# EAGLE schematic bm812i (EAGLE 6.6.0)

## Sheet 1 of 5
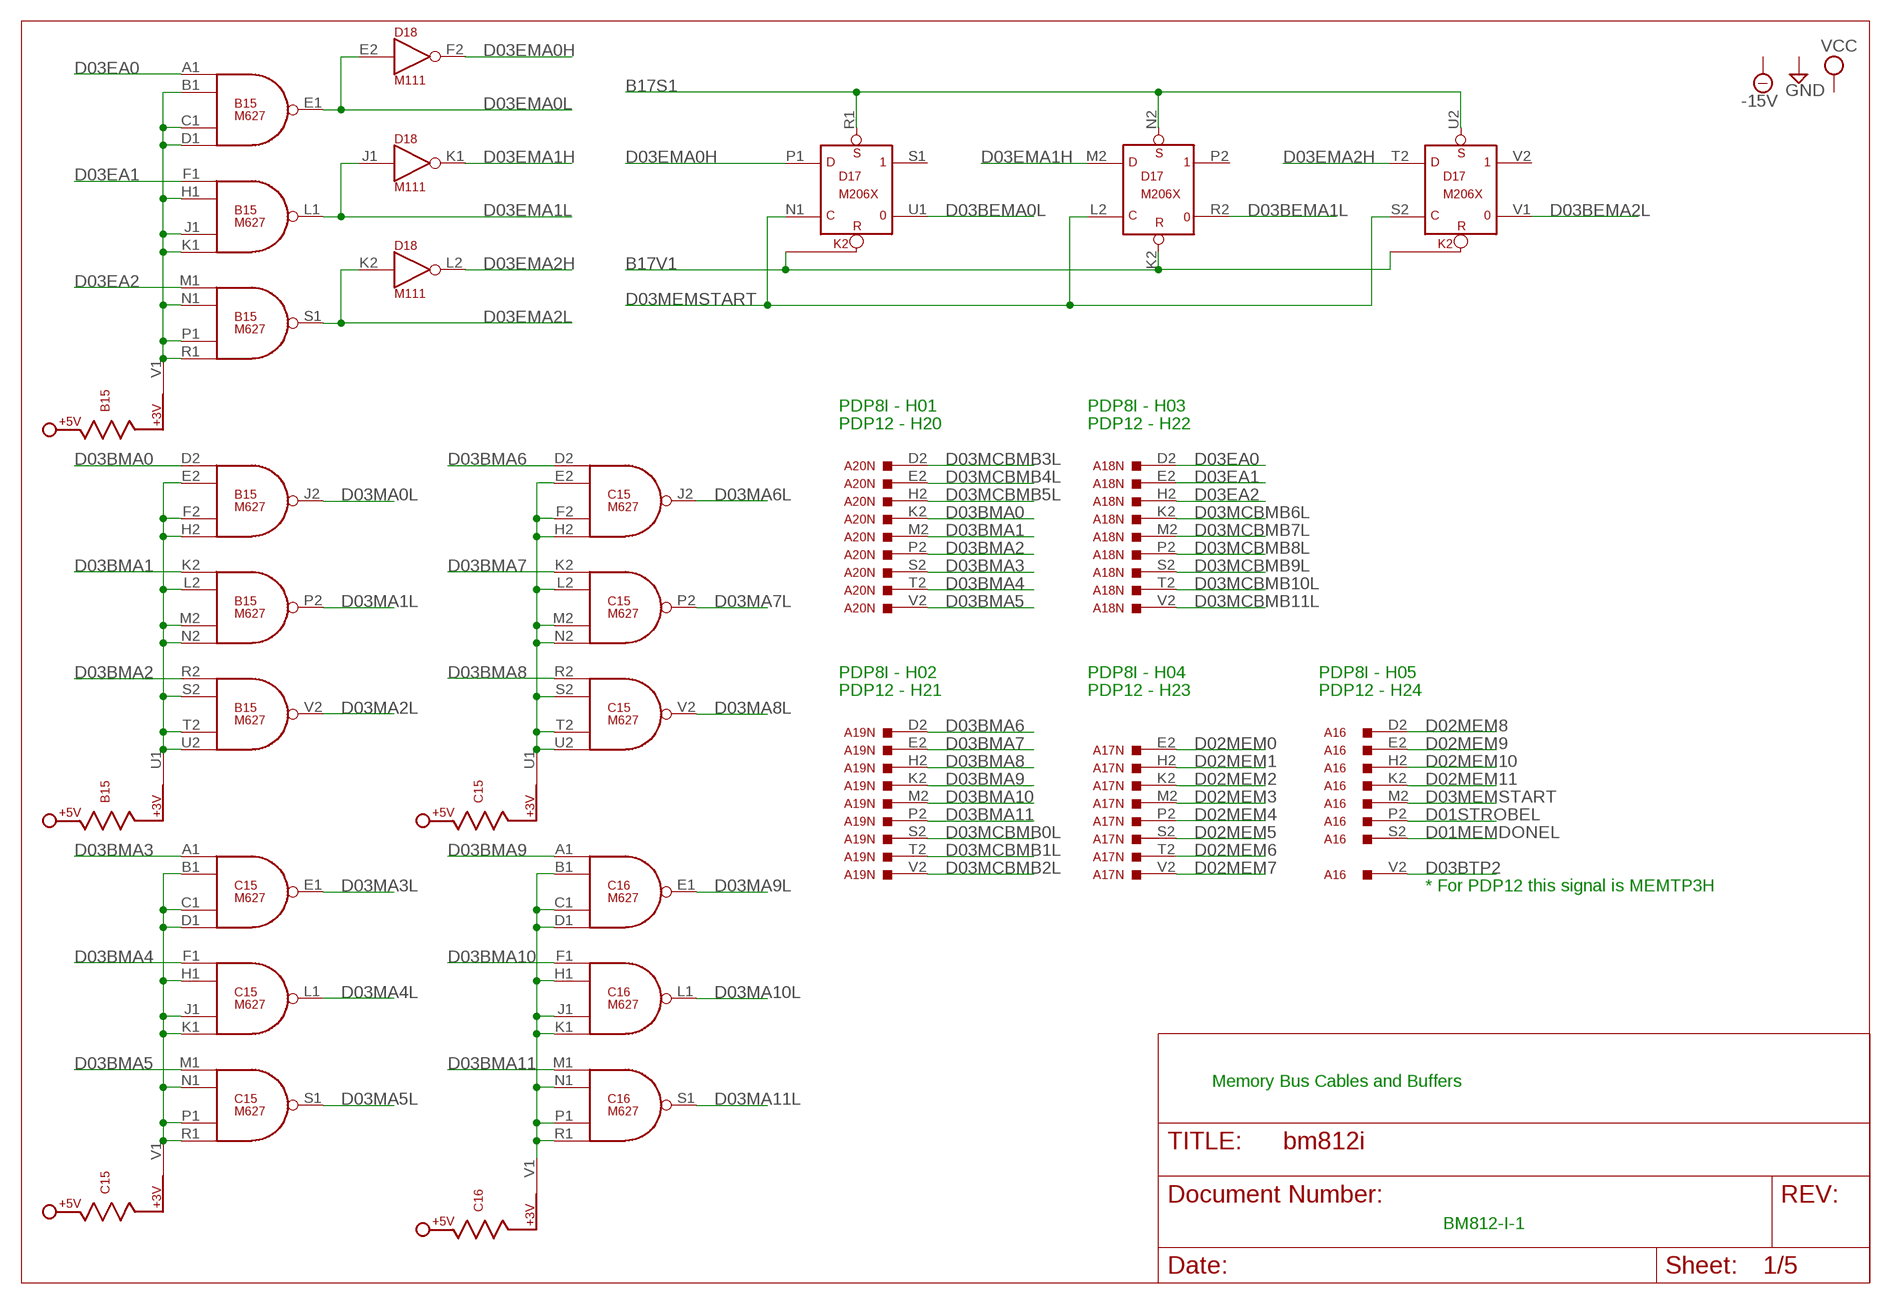
[diagram p0: schematic, sheet 1]

### Parts
A16  M903  [H807]
A17N  M903  [H807]
A18N  M903  [H807]
A19N  M903  [H807]
A20N  M903  [H807]
B15  M627  [H807]
C15  M627  [H807]
C16  M627  [H807]
D17  M206X  [H807]
D18  M111  [H807]

### Nets
B17S1: D17.N2(P2:S) D17.R1(S1:S) D17.U2(V2:S) ; also sheet 3,4
B17V1: D17.K2(P2:R) ; also sheet 3,4
D01MEMDONEL: A16.S2 ; also sheet 4
D01STROBEL: A16.P2 ; also sheet 4
D02MEM0: A17N.E2 ; also sheet 3
D02MEM1: A17N.H2 ; also sheet 3
D02MEM2: A17N.K2 ; also sheet 3
D02MEM3: A17N.M2 ; also sheet 3
D02MEM4: A17N.P2 ; also sheet 3
D02MEM5: A17N.S2 ; also sheet 3
D02MEM6: A17N.T2 ; also sheet 3
D02MEM7: A17N.V2 ; also sheet 3
D02MEM8: A16.D2 ; also sheet 3
D02MEM9: A16.E2 ; also sheet 3
D02MEM10: A16.H2 ; also sheet 3
D02MEM11: A16.K2 ; also sheet 3
D03BEMA0L: D17.U1 ; also sheet 5
D03BEMA1L: D17.R2 ; also sheet 5
D03BEMA2L: D17.V1 ; also sheet 5
D03BMA0: A20N.K2 B15.D2(J2:IN1)
D03BMA1: A20N.M2 B15.K2(P2:IN1)
D03BMA2: A20N.P2 B15.R2(V2:IN1)
D03BMA3: A20N.S2 C15.A1(E1:IN1)
D03BMA4: A20N.T2 C15.F1(L1:IN1)
D03BMA5: A20N.V2 C15.M1(S1:IN1)
D03BMA6: A19N.D2 C15.D2(J2:IN1)
D03BMA7: A19N.E2 C15.K2(P2:IN1)
D03BMA8: A19N.H2 C15.R2(V2:IN1)
D03BMA9: A19N.K2 C16.A1(E1:IN1)
D03BMA10: A19N.M2 C16.F1(L1:IN1)
D03BMA11: A19N.P2 C16.M1(S1:IN1)
D03BTP2: A16.V2 ; also sheet 4
D03EA0: A18N.D2 B15.A1(E1:IN1)
D03EA1: A18N.E2 B15.F1(L1:IN1)
D03EA2: A18N.H2 B15.M1(S1:IN1)
D03EMA0H: D17.P1(S1:D) D18.F2(F2:OUT) ; also sheet 4
D03EMA0L: B15.E1(E1:OUT) D18.E2(F2:IN) ; also sheet 4
D03EMA1H: D17.M2(P2:D) D18.K1(K1:OUT) ; also sheet 4
D03EMA1L: B15.L1(L1:OUT) D18.J1(K1:IN) ; also sheet 4
D03EMA2H: D17.T2(V2:D) D18.L2(L2:OUT) ; also sheet 4
D03EMA2L: B15.S1(S1:OUT) D18.K2(L2:IN) ; also sheet 4
D03MA0L: B15.J2(J2:OUT) ; also sheet 5
D03MA1L: B15.P2(P2:OUT) ; also sheet 5
D03MA2L: B15.V2(V2:OUT) ; also sheet 5
D03MA3L: C15.E1(E1:OUT) ; also sheet 5
D03MA4L: C15.L1(L1:OUT) ; also sheet 5
D03MA5L: C15.S1(S1:OUT) ; also sheet 5
D03MA6L: C15.J2(J2:OUT) ; also sheet 5
D03MA7L: C15.P2(P2:OUT) ; also sheet 5
D03MA8L: C15.V2(V2:OUT) ; also sheet 5
D03MA9L: C16.E1(E1:OUT) ; also sheet 5
D03MA10L: C16.L1(L1:OUT) ; also sheet 5
D03MA11L: C16.S1(S1:OUT) ; also sheet 5
D03MCBMB0L: A19N.S2 ; also sheet 3
D03MCBMB1L: A19N.T2 ; also sheet 3
D03MCBMB2L: A19N.V2 ; also sheet 3
D03MCBMB3L: A20N.D2 ; also sheet 3
D03MCBMB4L: A20N.E2 ; also sheet 3
D03MCBMB5L: A20N.H2 ; also sheet 3
D03MCBMB6L: A18N.K2 ; also sheet 3
D03MCBMB7L: A18N.M2 ; also sheet 3
D03MCBMB8L: A18N.P2 ; also sheet 3
D03MCBMB9L: A18N.S2 ; also sheet 3
D03MCBMB10L: A18N.T2 ; also sheet 3
D03MCBMB11L: A18N.V2 ; also sheet 3
D03MEMSTART: A16.M2 D17.L2(P2:C) D17.N1(S1:C) D17.S2(V2:C) ; also sheet 4
N$1: B15.B1(E1:IN2) B15.C1(E1:IN3) B15.D1(E1:IN4) B15.H1(L1:IN2) B15.J1(L1:IN3) B15.K1(L1:IN4) B15.N1(S1:IN2) B15.P1(S1:IN3) B15.R1(S1:IN4) B15.V1
N$2: B15.E2(J2:IN2) B15.F2(J2:IN3) B15.H2(J2:IN4) B15.L2(P2:IN2) B15.M2(P2:IN3) B15.N2(P2:IN4) B15.S2(V2:IN2) B15.T2(V2:IN3) B15.U1 B15.U2(V2:IN4)
N$4: C15.B1(E1:IN2) C15.C1(E1:IN3) C15.D1(E1:IN4) C15.H1(L1:IN2) C15.J1(L1:IN3) C15.K1(L1:IN4) C15.N1(S1:IN2) C15.P1(S1:IN3) C15.R1(S1:IN4) C15.V1
N$6: C15.E2(J2:IN2) C15.F2(J2:IN3) C15.H2(J2:IN4) C15.L2(P2:IN2) C15.M2(P2:IN3) C15.N2(P2:IN4) C15.S2(V2:IN2) C15.T2(V2:IN3) C15.U1 C15.U2(V2:IN4)
N$122: C16.B1(E1:IN2) C16.C1(E1:IN3) C16.D1(E1:IN4) C16.H1(L1:IN2) C16.J1(L1:IN3) C16.K1(L1:IN4) C16.N1(S1:IN2) C16.P1(S1:IN3) C16.R1(S1:IN4) C16.V1
Unconnected: A16.B1 A16.D1 A16.E1 A16.H1 A16.J1 A16.L1 A16.M1 A16.P1 A16.S1 A16.T2 A17N.B1 A17N.D1 A17N.D2 A17N.E1 A17N.H1 A17N.J1 A17N.L1 A17N.M1 A17N.P1 A17N.S1 A18N.B1 A18N.D1 A18N.E1 A18N.H1 A18N.J1 A18N.L1 A18N.M1 A18N.P1 A18N.S1 A19N.B1 A19N.D1 A19N.E1 A19N.H1 A19N.J1 A19N.L1 A19N.M1 A19N.P1 A19N.S1 A20N.B1 A20N.D1 A20N.E1 A20N.H1 A20N.J1 A20N.L1 A20N.M1 A20N.P1 A20N.S1 D17.D2(H2:C) D17.E2(H2:D) D17.F2(H2:S) D17.H1(L1:C) D17.H2 D17.J1(L1:D) D17.J2 D17.K1(L1:S) D17.L1 D17.M1 D17.P2 D17.S1 D17.V2 D18.L1(M1:IN) D18.M1(M1:OUT) D18.N1(P1:IN) D18.P1(P1:OUT) D18.P2(R2:IN) D18.R2(R2:OUT) D18.S2(T2:IN) D18.T2(T2:OUT) D18.U1(U1:OUT) D18.U2(V2:IN) D18.V1(U1:IN) D18.V2(V2:OUT)

### Notes on the sheet
- PDP8I - H01 | PDP8I - H03
- PDP12 - H20 | PDP12 - H22
- PDP8I - H02 | PDP8I - H04 | PDP8I - H05
- PDP12 - H21 | PDP12 - H23 | PDP12 - H24
- * For PDP12 this signal is MEMTP3H
- Memory Bus Cables and Buffers
- BM812-I-1

## Sheet 2 of 5
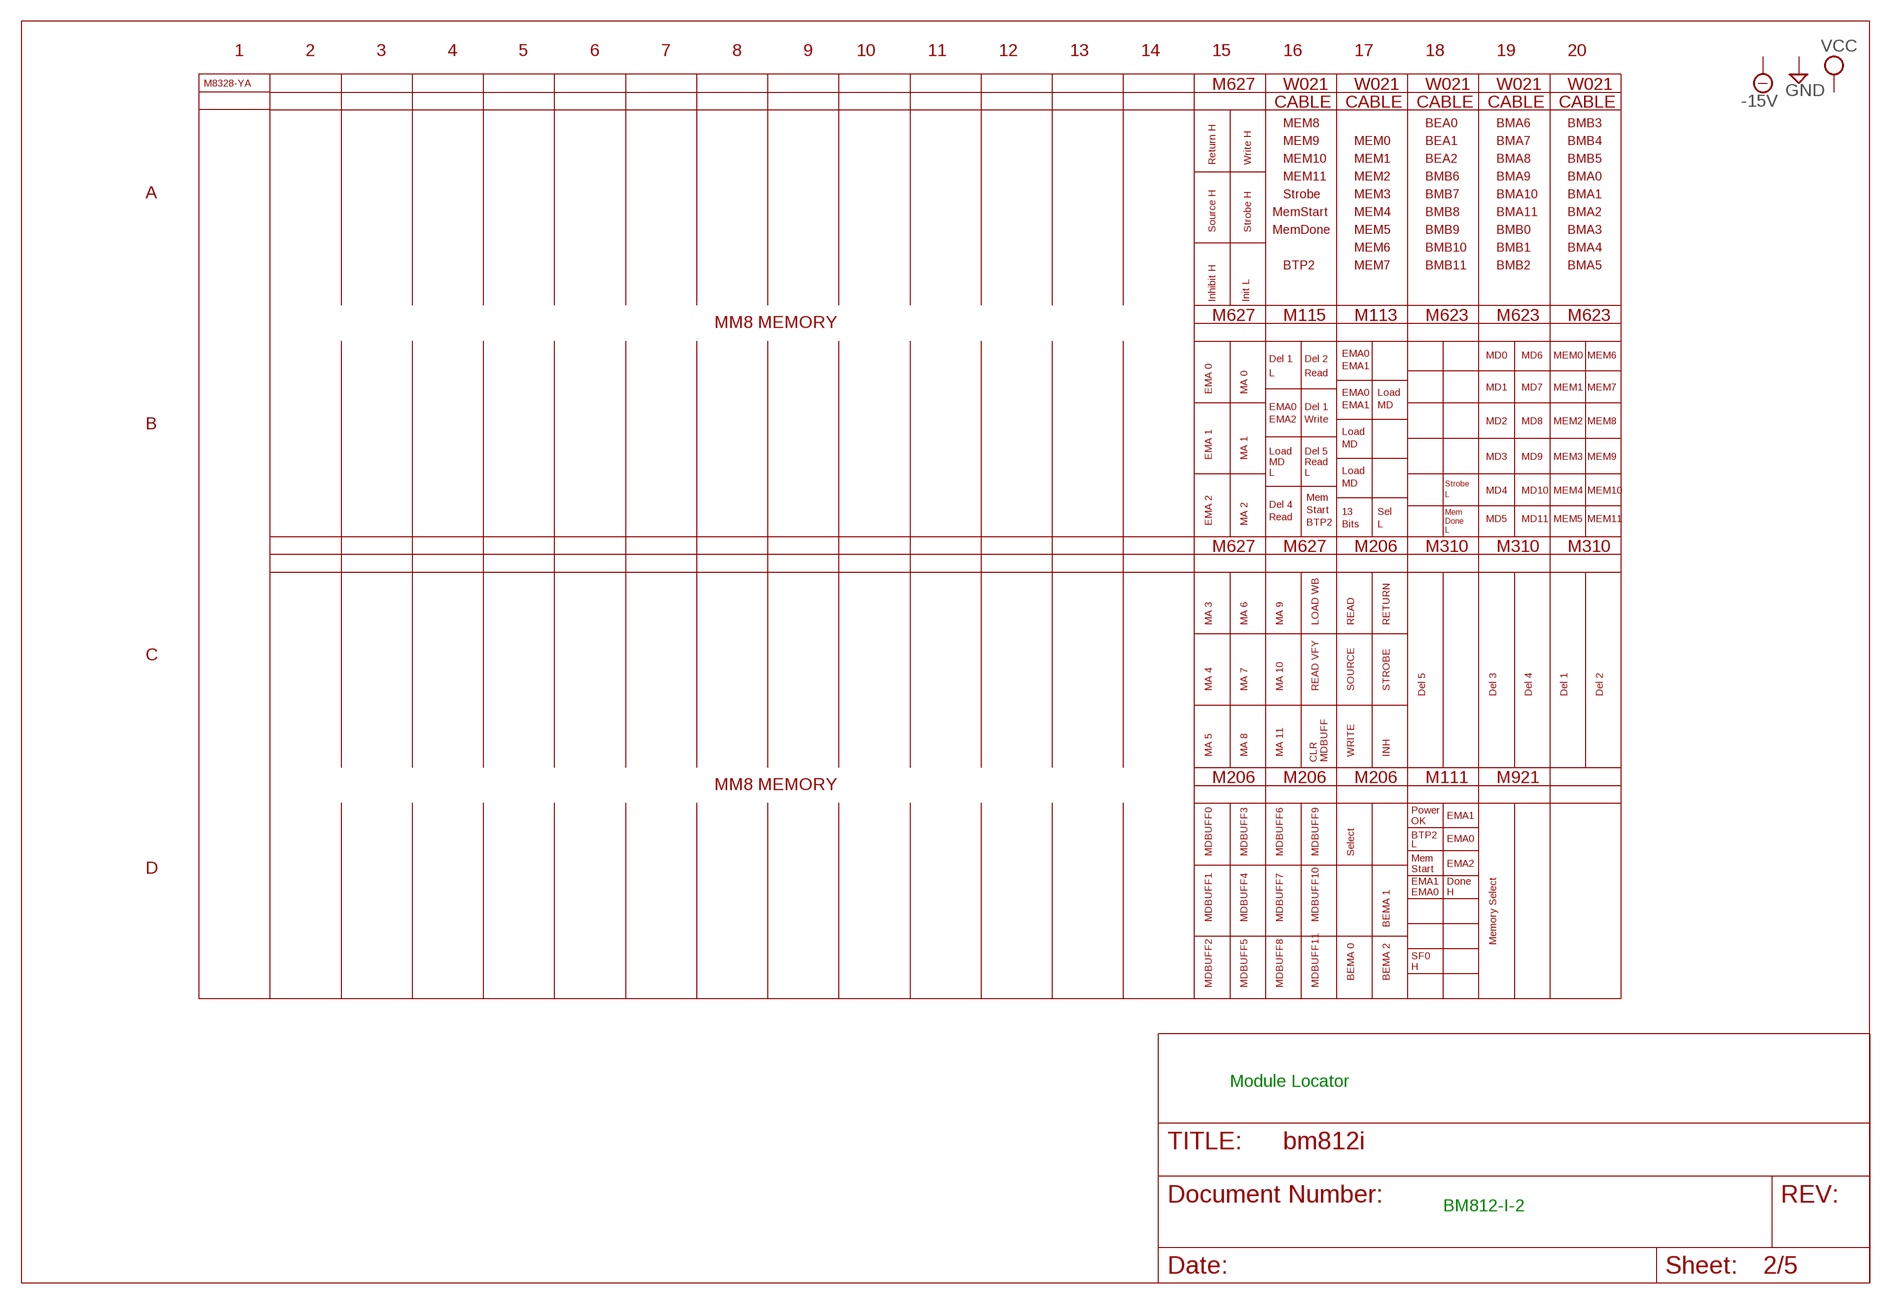
[diagram p1: schematic, sheet 2]

### Notes on the sheet
- 1 | 2 | 3 | 4 | 5 | 6 | 7 | 8 | 9 | 10 | 11 | 12 | 13 | 14 | 15 | 16 | 17 | 18 | 19 | 20
- M8328-YA
- M627 | W021 | W021 | W021 | W021 | W021
- CABLE | CABLE | CABLE | CABLE | CABLE
- MEM8 | BEA0 | BMA6 | BMB3
- MEM9 | MEM0 | BEA1 | BMA7 | BMB4
- Return H | Write H | MEM10 | MEM1 | BEA2 | BMA8 | BMB5
- MEM11 | MEM2 | BMB6 | BMA9 | BMA0
- A | Strobe | MEM3 | BMB7 | BMA10 | BMA1
- MemStart | MEM4 | BMB8 | BMA11 | BMA2
- Source H | Strobe H | MemDone | MEM5 | BMB9 | BMB0 | BMA3
- MEM6 | BMB10 | BMB1 | BMA4
- BTP2 | MEM7 | BMB11 | BMB2 | BMA5
- Inhibit H | Init L
- M627 | M115 | M113 | M623 | M623 | M623
- MM8 MEMORY
- EMA0 | MD0 | MD6 | MEM0 | MEM6
- Del 1 | Del 2
- EMA1
- L | Read
- MD1 | MD7 | MEM1 | MEM7
- EMA 0 | MA 0 | EMA0 | Load
- EMA0 | Del 1 | EMA1 | MD
- EMA2 | Write | MD2 | MD8 | MEM2 | MEM8
- B
- Load
- MD
- Load | Del 5
- EMA 1 | MA 1 | MD3 | MD9 | MEM3 | MEM9
- MD | Read
- L | L | Load
- MD | Strobe
- MD4 | MD10 | MEM4 | MEM10
- L
- Mem
- Del 4
- Start | 13 | Sel | Mem
- Read | MD5 | MD11 | MEM5 | MEM11
- EMA 2 | MA 2 | BTP2 | Done
- Bits | L
- L
- M627 | M627 | M206 | M310 | M310 | M310
- MA 3 | MA 6 | MA 9 | LOAD WB | READ | RETURN
- C
- MA 4 | MA 7 | MA 10 | READ VFY | SOURCE | STROBE
- Del 5 | Del 3 | Del 4 | Del 1 | Del 2
- MA 5 | MA 8 | MA 11 | WRITE | INH
- CLR | MDBUFF
- M206 | M206 | M206 | M111 | M921
- MM8 MEMORY
- Power
- EMA1
- OK
- BTP2
- EMA0
- L
- MDBUFF0 | MDBUFF3 | MDBUFF6 | MDBUFF9 | Select
- Mem
- EMA2
- D | Start
- EMA1 | Done
- EMA0 | H
- MDBUFF1 | MDBUFF4 | MDBUFF7 | MDBUFF10
- BEMA 1
- Memory Select
- SF0
- H
- BEMA 0 | BEMA 2
- MDBUFF2 | MDBUFF5 | MDBUFF8 | MDBUFF11
- Module Locator
- BM812-I-2

## Sheet 3 of 5
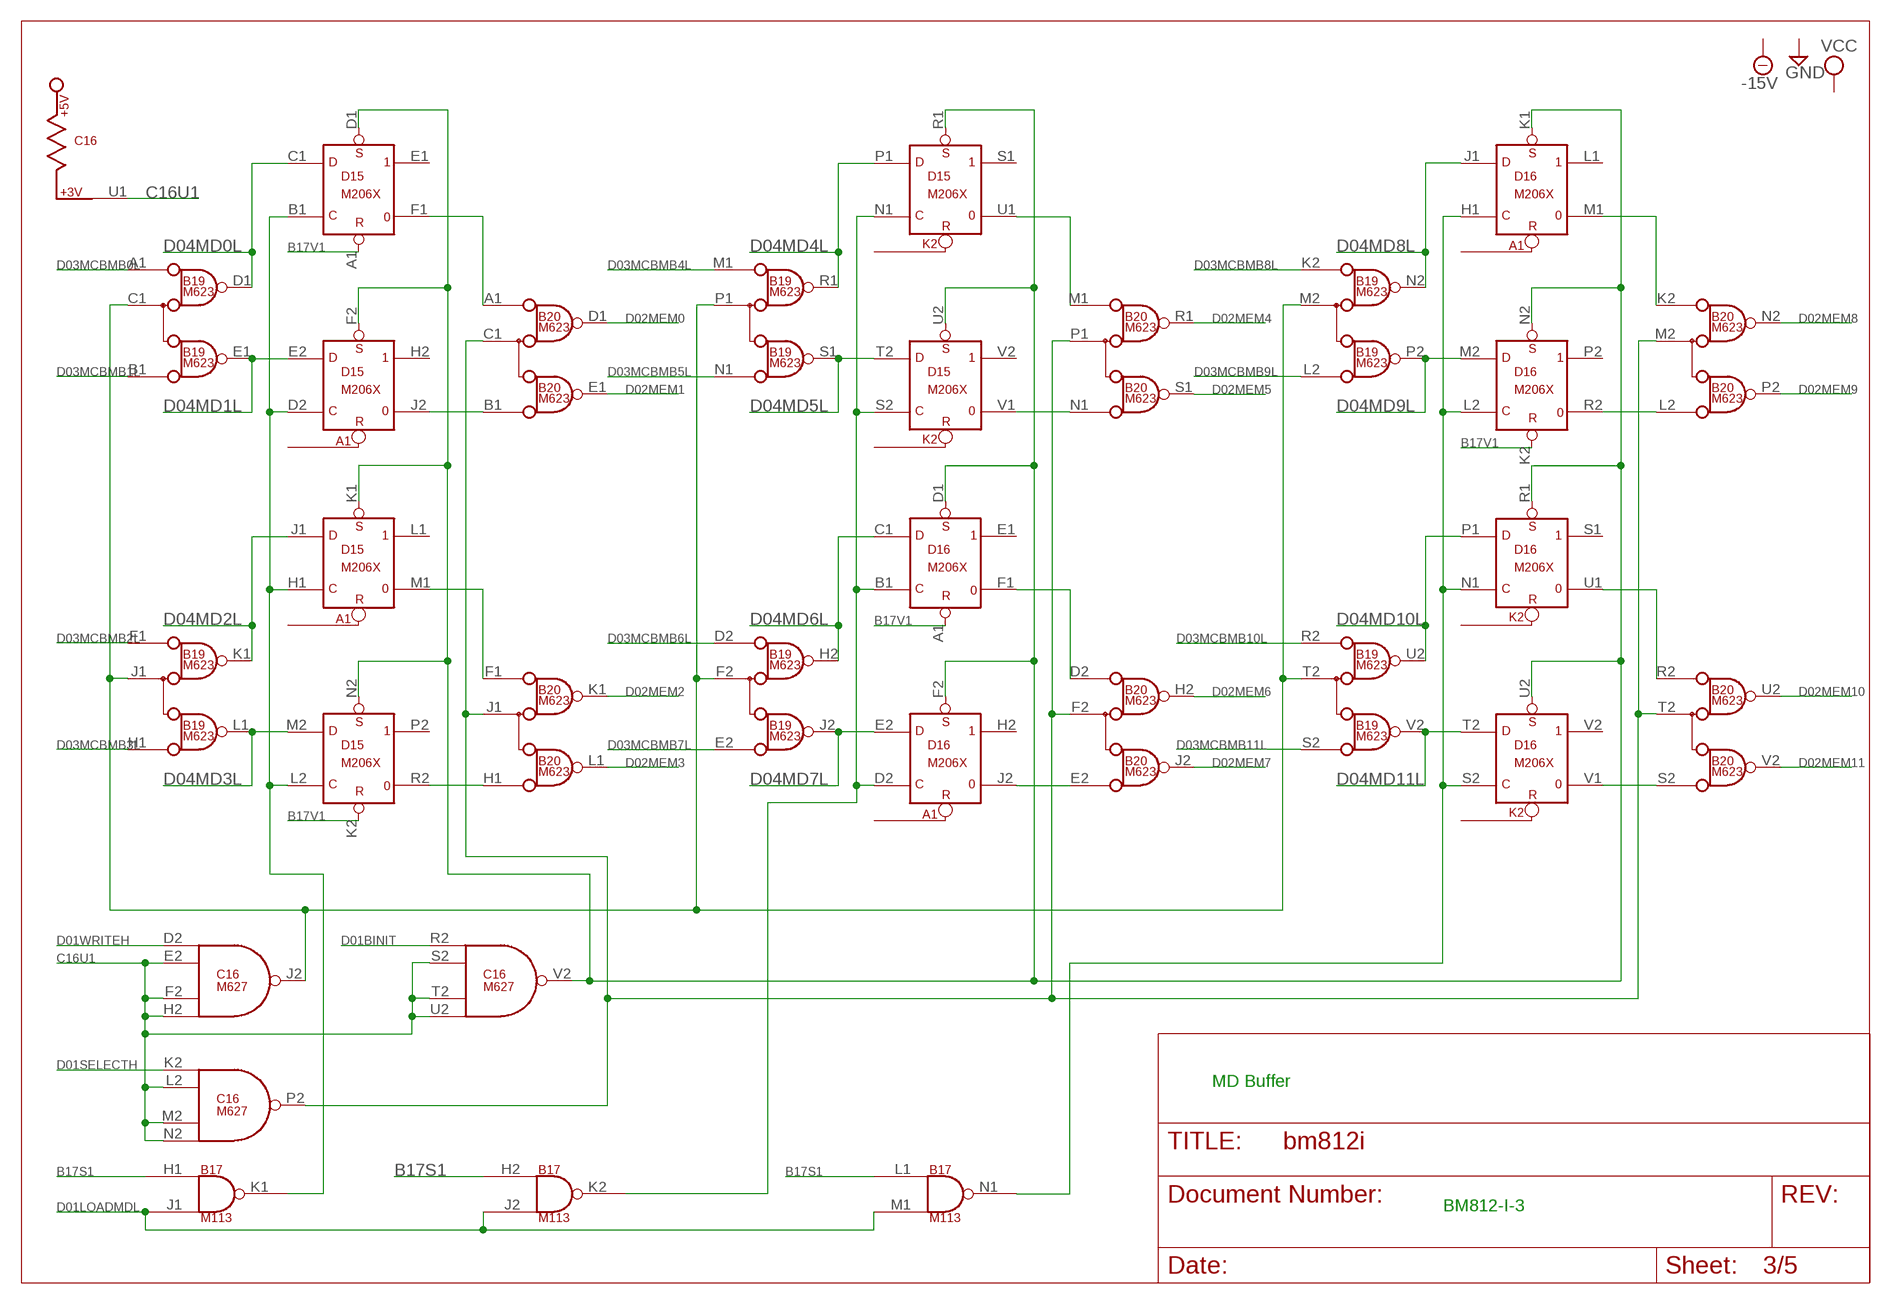
[diagram p2: schematic, sheet 3]

### Parts
B17  M113  [H807]
B19  M623  [H807]
B20  M623  [H807]
D15  M206X  [H807]
D16  M206X  [H807]

### Nets
B17S1: B17.H1(K1:IN1) B17.H2(K2:IN1) B17.L1(N1:IN1) ; also sheet 1,4
B17V1: D15.A1(E1:R) D15.K2(P2:R) D16.A1(E1:R) D16.K2(P2:R) ; also sheet 1,4
C16U1: C16.E2(J2:IN2) C16.F2(J2:IN3) C16.H2(J2:IN4) C16.L2(P2:IN2) C16.M2(P2:IN3) C16.N2(P2:IN4) C16.S2(V2:IN2) C16.T2(V2:IN3) C16.U1 C16.U2(V2:IN4)
D01BINIT: C16.R2(V2:IN1) ; also sheet 4
D01LOADMDL: B17.J1(K1:IN2) B17.J2(K2:IN2) B17.M1(N1:IN2) ; also sheet 4
D01SELECTH: C16.K2(P2:IN1) ; also sheet 4
D01WRITEH: C16.D2(J2:IN1) ; also sheet 4
D02MEM0: B20.D1(D1:D) ; also sheet 1
D02MEM1: B20.E1(D1:E) ; also sheet 1
D02MEM2: B20.K1(K1:D) ; also sheet 1
D02MEM3: B20.L1(K1:E) ; also sheet 1
D02MEM4: B20.R1(R1:D) ; also sheet 1
D02MEM5: B20.S1(R1:E) ; also sheet 1
D02MEM6: B20.H2(H2:D) ; also sheet 1
D02MEM7: B20.J2(H2:E) ; also sheet 1
D02MEM8: B20.N2(N2:D) ; also sheet 1
D02MEM9: B20.P2(N2:E) ; also sheet 1
D02MEM10: B20.U2(U2:D) ; also sheet 1
D02MEM11: B20.V2(U2:E) ; also sheet 1
D03MCBMB0L: B19.A1(D1:A) ; also sheet 1
D03MCBMB1L: B19.B1(D1:B) ; also sheet 1
D03MCBMB2L: B19.F1(K1:A) ; also sheet 1
D03MCBMB3L: B19.H1(K1:B) ; also sheet 1
D03MCBMB4L: B19.M1(R1:A) ; also sheet 1
D03MCBMB5L: B19.N1(R1:B) ; also sheet 1
D03MCBMB6L: B19.D2(H2:A) ; also sheet 1
D03MCBMB7L: B19.E2(H2:B) ; also sheet 1
D03MCBMB8L: B19.K2(N2:A) ; also sheet 1
D03MCBMB9L: B19.L2(N2:B) ; also sheet 1
D03MCBMB10L: B19.R2(U2:A) ; also sheet 1
D03MCBMB11L: B19.S2(U2:B) ; also sheet 1
D04MD0L: B19.D1(D1:D) D15.C1(E1:D) ; also sheet 5
D04MD1L: B19.E1(D1:E) D15.E2(H2:D) ; also sheet 5
D04MD2L: B19.K1(K1:D) D15.J1(L1:D) ; also sheet 5
D04MD3L: B19.L1(K1:E) D15.M2(P2:D) ; also sheet 5
D04MD4L: B19.R1(R1:D) D15.P1(S1:D) ; also sheet 5
D04MD5L: B19.S1(R1:E) D15.T2(V2:D) ; also sheet 5
D04MD6L: B19.H2(H2:D) D16.C1(E1:D) ; also sheet 5
D04MD7L: B19.J2(H2:E) D16.E2(H2:D) ; also sheet 5
D04MD8L: B19.N2(N2:D) D16.J1(L1:D) ; also sheet 5
D04MD9L: B19.P2(N2:E) D16.M2(P2:D) ; also sheet 5
D04MD10L: B19.U2(U2:D) D16.P1(S1:D) ; also sheet 5
D04MD11L: B19.V2(U2:E) D16.T2(V2:D) ; also sheet 5
N$8: B17.K1(K1:OUT) D15.B1(E1:C) D15.D2(H2:C) D15.H1(L1:C) D15.L2(P2:C)
N$12: B20.H1(K1:B) D15.R2
N$14: B20.A1(D1:A) D15.F1
N$15: B20.B1(D1:B) D15.J2
N$16: B17.K2(K2:OUT) D15.N1(S1:C) D15.S2(V2:C) D16.B1(E1:C) D16.D2(H2:C)
N$17: B20.F1(K1:A) D15.M1
N$20: B19.C1(D1:C) B19.F2(H2:C) B19.J1(K1:C) B19.M2(N2:C) B19.P1(R1:C) B19.T2(U2:C) C16.J2(J2:OUT)
N$21: C16.V2(V2:OUT) D15.D1(E1:S) D15.F2(H2:S) D15.K1(L1:S) D15.N2(P2:S) D15.R1(S1:S) D15.U2(V2:S) D16.D1(E1:S) D16.F2(H2:S) D16.K1(L1:S) D16.N2(P2:S) D16.R1(S1:S) D16.U2(V2:S)
N$22: B20.C1(D1:C) B20.F2(H2:C) B20.J1(K1:C) B20.M2(N2:C) B20.P1(R1:C) B20.T2(U2:C) C16.P2(P2:OUT)
N$24: B20.N1(R1:B) D15.V1
N$25: B20.E2(H2:B) D16.J2
N$26: B20.D2(H2:A) D16.F1
N$27: B20.M1(R1:A) D15.U1
N$29: B20.S2(U2:B) D16.V1
N$30: B20.R2(U2:A) D16.U1
N$41: B17.N1(N1:OUT) D16.H1(L1:C) D16.L2(P2:C) D16.N1(S1:C) D16.S2(V2:C)
N$67: B20.L2(N2:B) D16.R2
N$68: B20.K2(N2:A) D16.M1
Unconnected: B17.D2(F2:IN1) B17.E2(F2:IN2) B17.F2(F2:OUT) B17.L2(N2:IN1) B17.M2(N2:IN2) B17.N2(N2:OUT) B17.P2(S2:IN1) B17.R2(S2:IN2) B17.S2(S2:OUT) D15.E1 D15.H2 D15.L1 D15.P2 D15.S1 D15.V2 D16.E1 D16.H2 D16.L1 D16.P2 D16.S1 D16.V2

### Notes on the sheet
- MD Buffer
- BM812-I-3

## Sheet 4 of 5
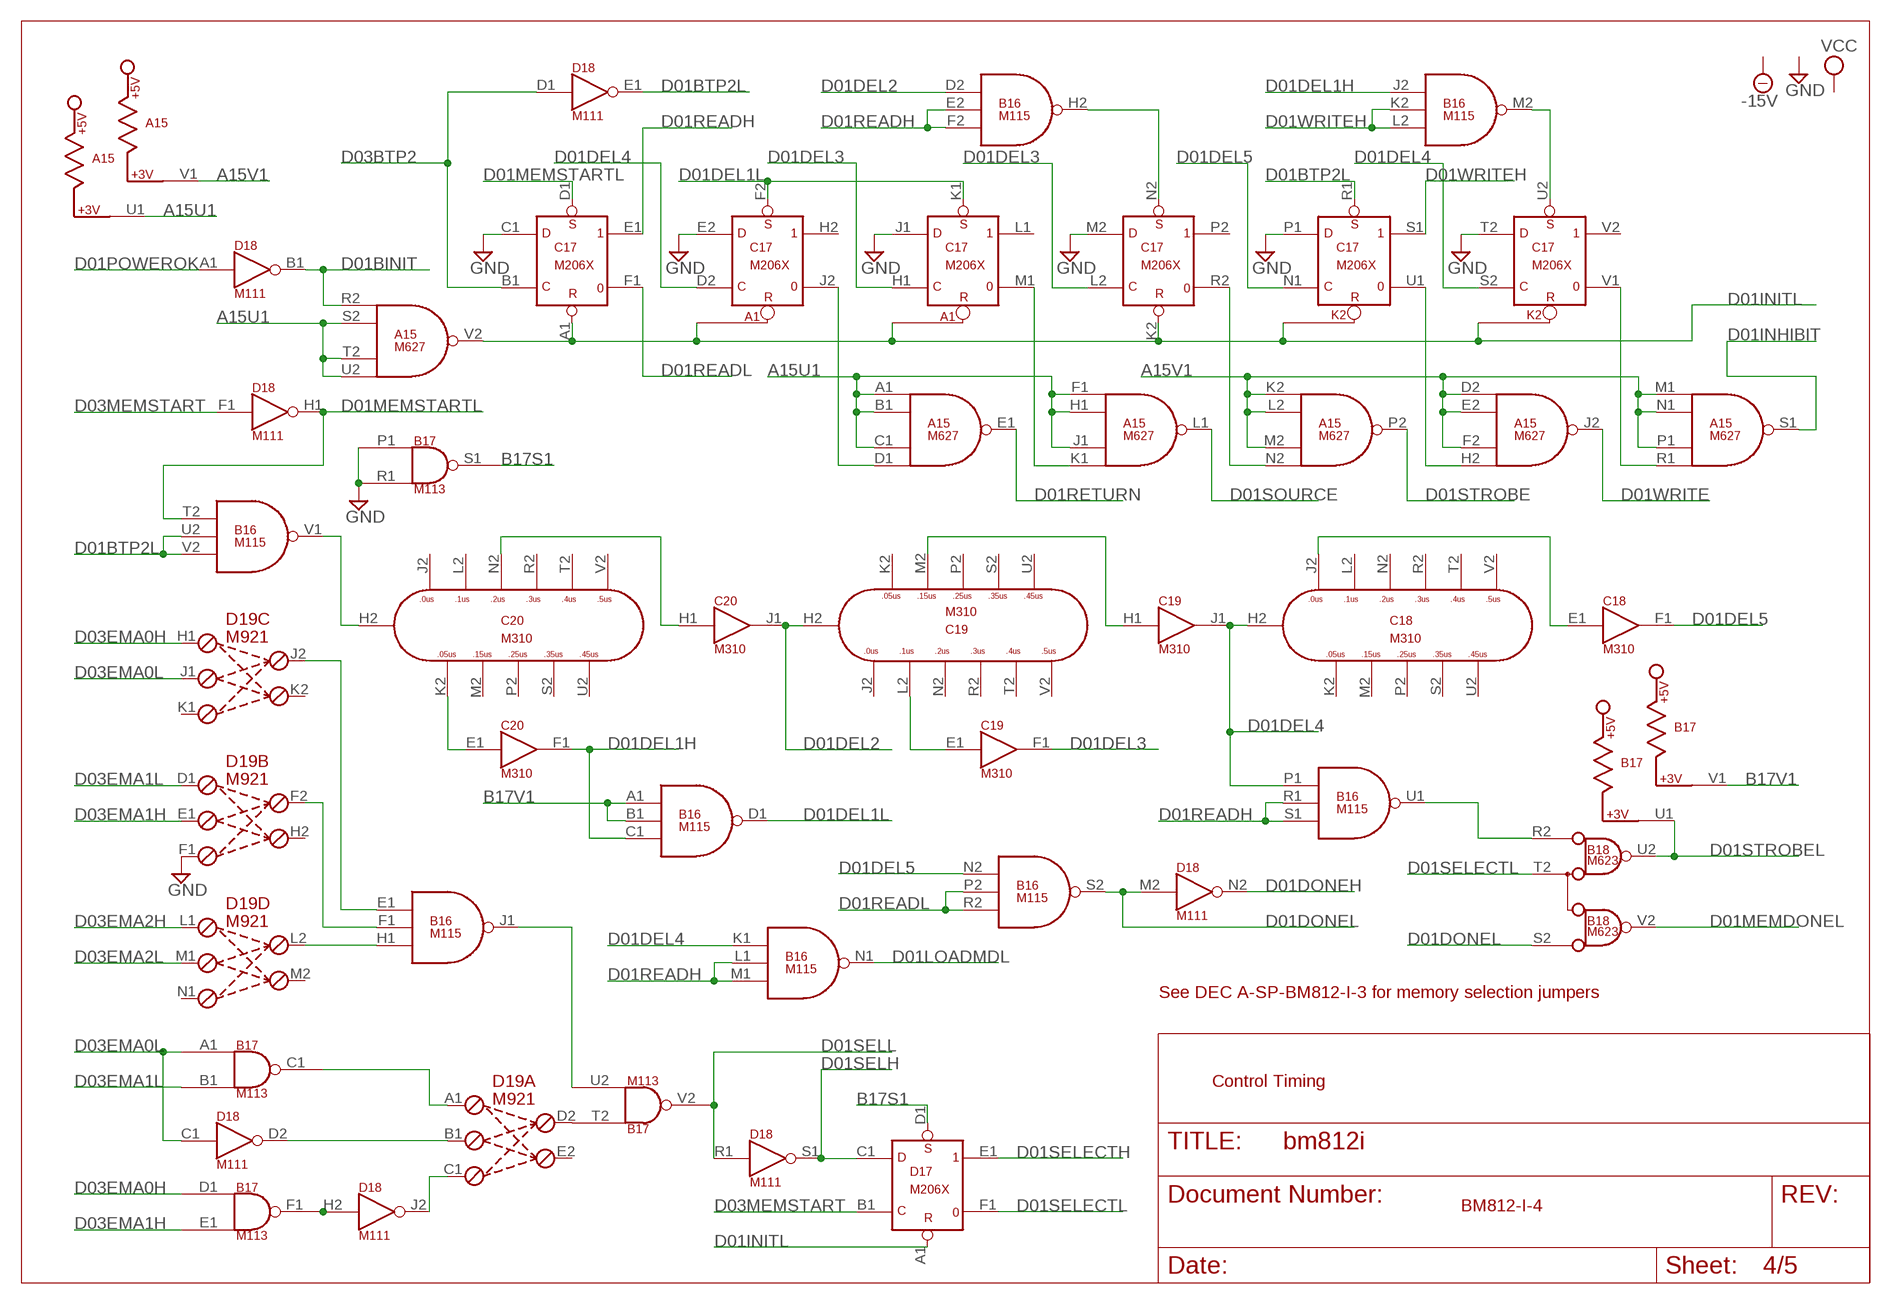
[diagram p3: schematic, sheet 4]

### Parts
A15  M627  [H807]
B16  M115  [H807]
B18  M623  [H807]
C17  M206X  [H807]
C18  M310  [H807]
C19  M310  [H807]
C20  M310  [H807]
D19  M921  [H807]

### Nets
A15U1: A15.A1(E1:IN1) A15.B1(E1:IN2) A15.C1(E1:IN3) A15.F1(L1:IN1) A15.H1(L1:IN2) A15.J1(L1:IN3) A15.S2(V2:IN2) A15.T2(V2:IN3) A15.U1 A15.U2(V2:IN4) ; also sheet 5
A15V1: A15.D2(J2:IN1) A15.E2(J2:IN2) A15.F2(J2:IN3) A15.K2(P2:IN1) A15.L2(P2:IN2) A15.M1(S1:IN1) A15.M2(P2:IN3) A15.N1(S1:IN2) A15.P1(S1:IN3) A15.V1
B17S1: B17.S1(S1:OUT) D17.D1(E1:S) ; also sheet 1,3
B17V1: B16.A1(D1:IN1) B16.B1(D1:IN2) B17.V1 ; also sheet 1,3
D01BINIT: A15.R2(V2:IN1) D18.B1(B1:OUT) ; also sheet 3
D01BTP2L: B16.U2(V1:IN2) B16.V2(V1:IN3) C17.R1(S1:S) D18.E1(E1:OUT)
D01DEL1H: B16.C1(D1:IN3) B16.J2(M2:IN1) C20.F1(F1:OUT)
D01DEL1L: B16.D1(D1:OUT) C17.F2(H2:S) C17.K1(L1:S)
D01DEL2: B16.D2(H2:IN1) C19.H2(H2:H2) C20.J1(J1:OUT)
D01DEL3: C17.H1(L1:C) C17.L2(P2:C) C19.F1(F1:OUT)
D01DEL4: B16.K1(N1:IN1) B16.P1(U1:IN1) C17.D2(H2:C) C17.S2(V2:C) C18.H2(H2:H2) C19.J1(J1:OUT)
D01DEL5: B16.N2(S2:IN1) C17.N1(S1:C) C18.F1(F1:OUT)
D01DONEH: D18.N2(N2:OUT) ; also sheet 5
D01DONEL: B16.S2(S2:OUT) B18.S2(U2:B) D18.M2(N2:IN)
D01INHIBIT: A15.S1(S1:OUT) ; also sheet 5
D01INITL: A15.V2(V2:OUT) C17.A1(E1:R) C17.K2(P2:R) D17.A1(E1:R)
D01LOADMDL: B16.N1(N1:OUT) ; also sheet 3
D01MEMDONEL: B18.V2(U2:E) ; also sheet 1
D01MEMSTARTL: B16.T2(V1:IN1) C17.D1(E1:S) D18.H1(H1:OUT)
D01POWEROK: D18.A1(B1:IN) ; also sheet 5
D01READH: B16.E2(H2:IN2) B16.F2(H2:IN3) B16.L1(N1:IN2) B16.M1(N1:IN3) B16.R1(U1:IN2) B16.S1(U1:IN3) C17.E1
D01READL: B16.P2(S2:IN2) B16.R2(S2:IN3) C17.F1 ; also sheet 5
D01RETURN: A15.E1(E1:OUT) ; also sheet 5
D01SELECTH: D17.E1 ; also sheet 3
D01SELECTL: B18.T2(U2:C) D17.F1
D01SELH: D17.C1(E1:D) D18.S1(S1:OUT)
D01SELL: B17.V2(V2:OUT) D18.R1(S1:IN)
D01SOURCE: A15.L1(L1:OUT) ; also sheet 5
D01STROBE: A15.P2(P2:OUT) ; also sheet 5
D01STROBEL: B17.U1 B18.U2(U2:D) ; also sheet 1
D01WRITE: A15.J2(J2:OUT) ; also sheet 5
D01WRITEH: B16.K2(M2:IN2) B16.L2(M2:IN3) C17.S1 ; also sheet 3
D03BTP2: C17.B1(E1:C) D18.D1(E1:IN) ; also sheet 1
D03EMA0H: B17.D1(F1:IN1) D19.H1(C:L1) ; also sheet 1
D03EMA0L: B17.A1(C1:IN1) D18.C1(D2:IN) D19.J1(C:L2) ; also sheet 1
D03EMA1H: B17.E1(F1:IN2) D19.E1(B:L2) ; also sheet 1
D03EMA1L: B17.B1(C1:IN2) D19.D1(B:L1) ; also sheet 1
D03EMA2H: D19.L1(D:L1) ; also sheet 1
D03EMA2L: D19.M1(D:L2) ; also sheet 1
D03MEMSTART: D17.B1(E1:C) D18.F1(H1:IN) ; also sheet 1
GND [Power]: B17.P1(S1:IN1) B17.R1(S1:IN2) C17.C1(E1:D) C17.E2(H2:D) C17.J1(L1:D) C17.M2(P2:D) C17.P1(S1:D) C17.T2(V2:D) D19.F1(B:L3) ; also sheet 5
N$34: C19.H1(J1:IN) C19.M2(H2:M2)
N$35: B16.V1(V1:OUT) C20.H2(H2:H2)
N$46: B16.H2(H2:OUT) C17.N2(P2:S)
N$73: B17.C1(C1:OUT) D19.A1(A:L1)
N$91: C20.E1(F1:IN) C20.K2(H2:K2)
N$92: B16.M2(M2:OUT) C17.U2(V2:S)
N$93: C20.H1(J1:IN) C20.N2(H2:N2)
N$94: B16.U1(U1:OUT) B18.R2(U2:A)
N$96: A15.D1(E1:IN4) C17.J2
N$97: C19.E1(F1:IN) C19.L2(H2:L2)
N$99: C18.E1(F1:IN) C18.J2(H2:J2)
N$100: A15.K1(L1:IN4) C17.M1
N$101: A15.N2(P2:IN4) C17.R2
N$103: D18.D2(D2:OUT) D19.B1(A:L2)
N$104: A15.H2(J2:IN4) C17.U1
N$108: B17.F1(F1:OUT) D18.H2(J2:IN)
N$109: A15.R1(S1:IN4) C17.V1
N$111: D18.J2(J2:OUT) D19.C1(A:L3)
N$112: B17.T2(V2:IN1) D19.D2(A:R1)
N$113: B16.H1(J1:IN3) D19.L2(D:R1)
N$128: B16.F1(J1:IN2) D19.F2(B:R1)
N$129: B16.E1(J1:IN1) D19.J2(C:R1)
N$132: B16.J1(J1:OUT) B17.U2(V2:IN2)
Unconnected: B18.A1(D1:A) B18.B1(D1:B) B18.C1(D1:C) B18.D1(D1:D) B18.D2(H2:A) B18.E1(D1:E) B18.E2(H2:B) B18.F1(K1:A) B18.F2(H2:C) B18.H1(K1:B) B18.H2(H2:D) B18.J1(K1:C) B18.J2(H2:E) B18.K1(K1:D) B18.K2(N2:A) B18.L1(K1:E) B18.L2(N2:B) B18.M1(R1:A) B18.M2(N2:C) B18.N1(R1:B) B18.N2(N2:D) B18.P1(R1:C) B18.P2(N2:E) B18.R1(R1:D) B18.S1(R1:E) C17.H2 C17.L1 C17.P2 C17.V2 C18.H1(J1:IN) C18.J1(J1:OUT) C18.K2(H2:K2) C18.L2(H2:L2) C18.M2(H2:M2) C18.N2(H2:N2) C18.P2(H2:P2) C18.R2(H2:R2) C18.S2(H2:S2) C18.T2(H2:T2) C18.U2(H2:U2) C18.V2(H2:V2) C19.J2(H2:J2) C19.K2(H2:K2) C19.N2(H2:N2) C19.P2(H2:P2) C19.R2(H2:R2) C19.S2(H2:S2) C19.T2(H2:T2) C19.U2(H2:U2) C19.V2(H2:V2) C20.J2(H2:J2) C20.L2(H2:L2) C20.M2(H2:M2) C20.P2(H2:P2) C20.R2(H2:R2) C20.S2(H2:S2) C20.T2(H2:T2) C20.U2(H2:U2) C20.V2(H2:V2) D19.E2(A:R2) D19.H2(B:R2) D19.K1(C:L3) D19.K2(C:R2) D19.M2(D:R2) D19.N1(D:L3) D19.N2(E:R1) D19.P1(E:L1) D19.P2(E:R2) D19.R1(E:L2) D19.R2(F:R2) D19.S1(E:L3) D19.S2(F:L1) D19.T2(F:R1) D19.U1(F:L2) D19.V1(F:L3)

### Notes on the sheet
- See DEC A-SP-BM812-I-3 for memory selection jumpers
- Control Timing
- BM812-I-4

## Sheet 5 of 5
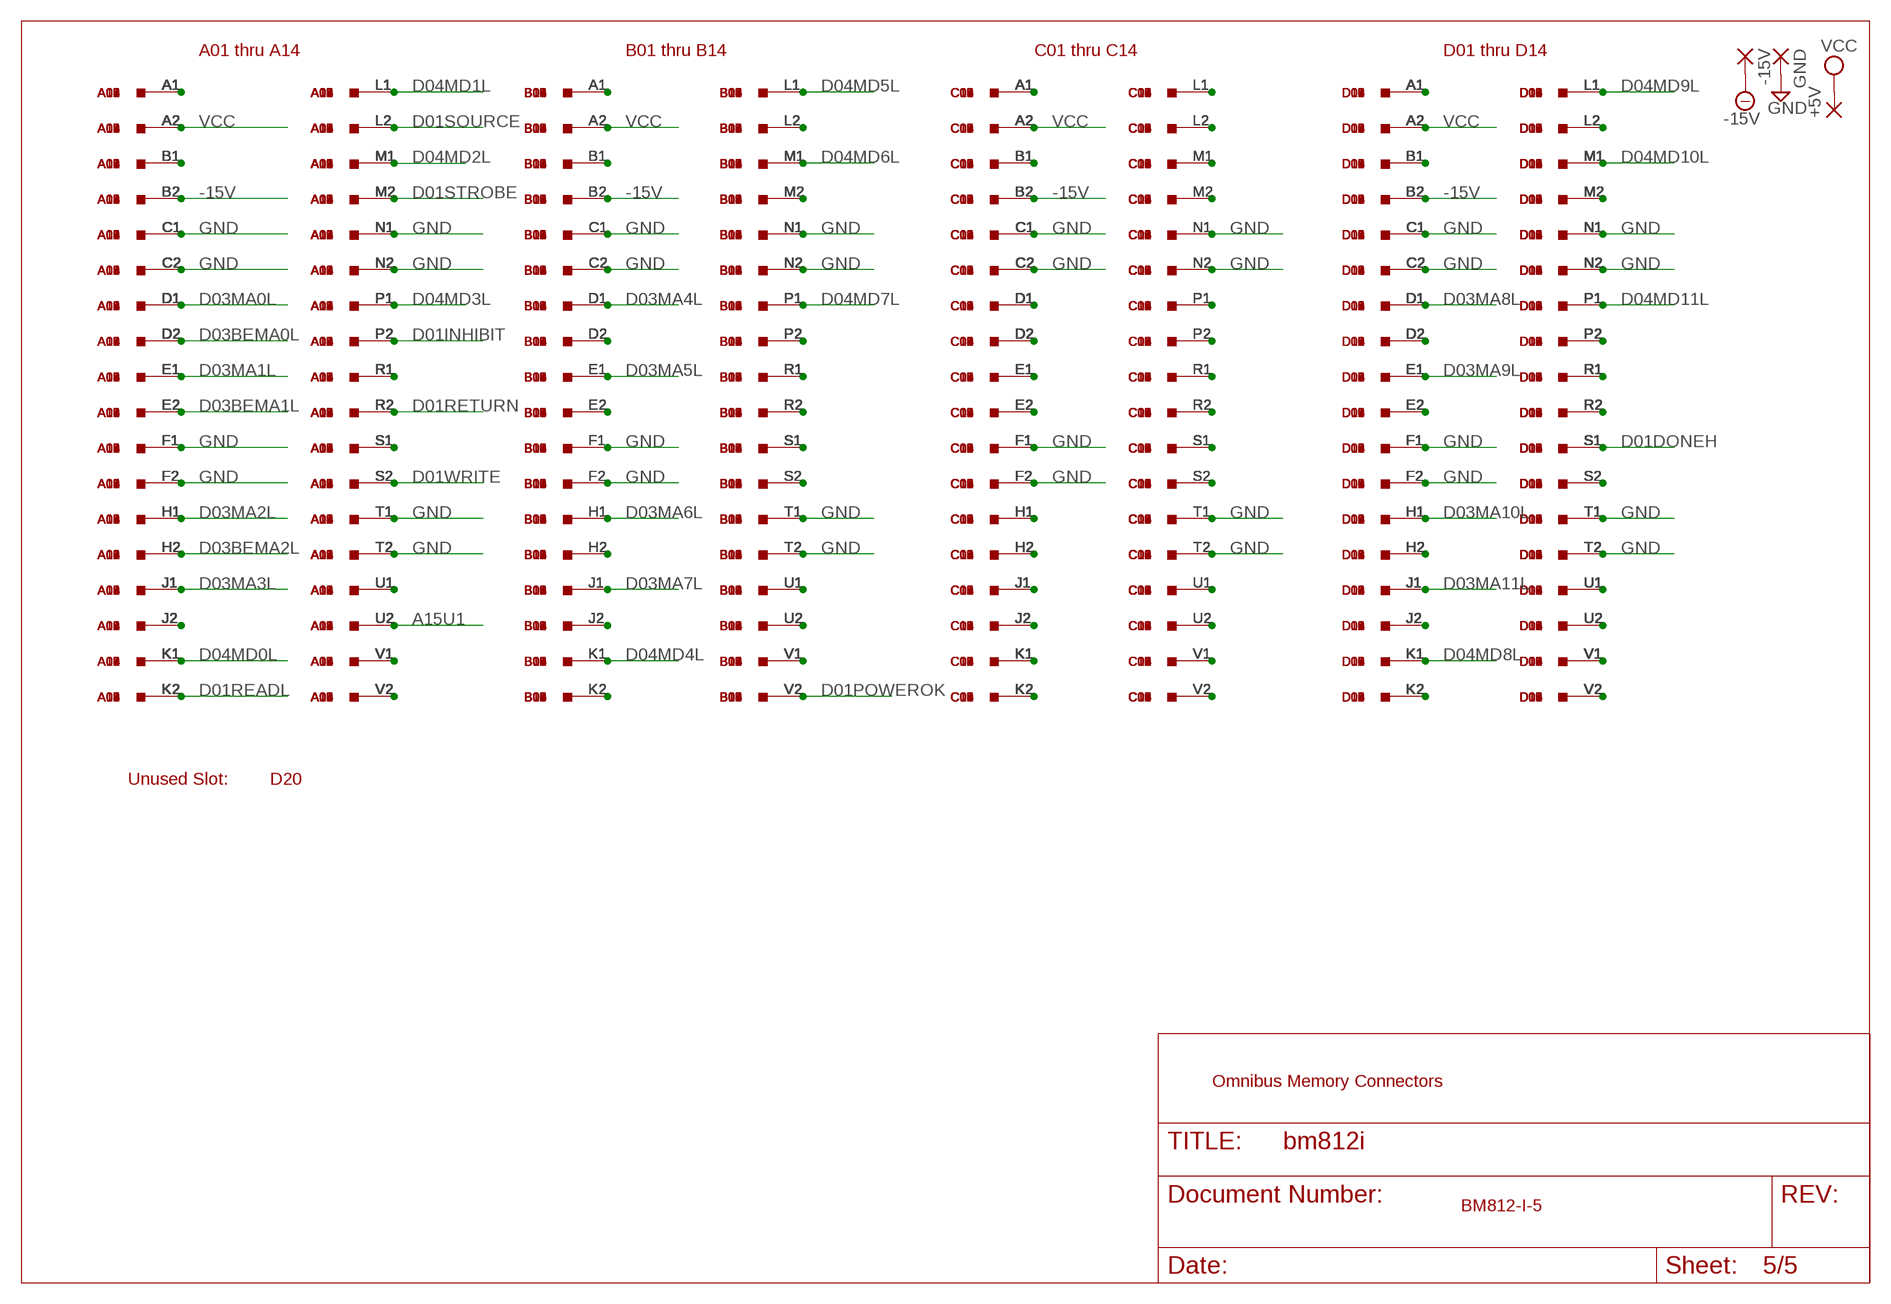
[diagram p4: schematic, sheet 5]

### Parts
+5V  2,54/0,8  [2,54/0,8]
-15V  2,54/0,8  [2,54/0,8]
A01  M916  [H807]
A02  M916  [H807]
A03  M916  [H807]
A04  M916  [H807]
A05  M916  [H807]
A06  M916  [H807]
A07  M916  [H807]
A08  M916  [H807]
A09  M916  [H807]
A10  M916  [H807]
A11  M916  [H807]
A12  M916  [H807]
A13  M916  [H807]
A14  M916  [H807]
B01  M916  [H807]
B02  M916  [H807]
B03  M916  [H807]
B04  M916  [H807]
B05  M916  [H807]
B06  M916  [H807]
B07  M916  [H807]
B08  M916  [H807]
B09  M916  [H807]
B10  M916  [H807]
B11  M916  [H807]
B12  M916  [H807]
B13  M916  [H807]
B14  M916  [H807]
C01  M916  [H807]
C02  M916  [H807]
C03  M916  [H807]
C04  M916  [H807]
C05  M916  [H807]
C06  M916  [H807]
C07  M916  [H807]
C08  M916  [H807]
C09  M916  [H807]
C10  M916  [H807]
C11  M916  [H807]
C12  M916  [H807]
C13  M916  [H807]
C14  M916  [H807]
D01  M916  [H807]
D02  M916  [H807]
D03  M916  [H807]
D04  M916  [H807]
D05  M916  [H807]
D06  M916  [H807]
D07  M916  [H807]
D08  M916  [H807]
D09  M916  [H807]
D10  M916  [H807]
D11  M916  [H807]
D12  M916  [H807]
D13  M916  [H807]
D14  M916  [H807]
D20  H807  [H807]
GND  2,54/0,8  [2,54/0,8]

### Nets
-15V [Power]: -15V.1(P) A01.B2 A02.B2 A03.B2 A04.B2 A05.B2 A06.B2 A07.B2 A08.B2 A09.B2 A10.B2 A11.B2 A12.B2 A13.B2 A14.B2 B01.B2 B02.B2 B03.B2 B04.B2 B05.B2 B06.B2 B07.B2 B08.B2 B09.B2 B10.B2 B11.B2 B12.B2 B13.B2 B14.B2 C01.B2 C02.B2 C03.B2 C04.B2 C05.B2 C06.B2 C07.B2 C08.B2 C09.B2 C10.B2 C11.B2 C12.B2 C13.B2 C14.B2 D01.B2 D02.B2 D03.B2 D04.B2 D05.B2 D06.B2 D07.B2 D08.B2 D09.B2 D10.B2 D11.B2 D12.B2 D13.B2 D14.B2
A15U1: A01.U2 A02.U2 A03.U2 A04.U2 A05.U2 A06.U2 A07.U2 A08.U2 A09.U2 A10.U2 A11.U2 A12.U2 A13.U2 A14.U2 ; also sheet 4
D01DONEH: D01.S1 D02.S1 D03.S1 D04.S1 D05.S1 D06.S1 D07.S1 D08.S1 D09.S1 D10.S1 D11.S1 D12.S1 D13.S1 D14.S1 ; also sheet 4
D01INHIBIT: A01.P2 A02.P2 A03.P2 A04.P2 A05.P2 A06.P2 A07.P2 A08.P2 A09.P2 A10.P2 A11.P2 A12.P2 A13.P2 A14.P2 ; also sheet 4
D01POWEROK: B01.V2 B02.V2 B03.V2 B04.V2 B05.V2 B06.V2 B07.V2 B08.V2 B09.V2 B10.V2 B11.V2 B12.V2 B13.V2 B14.V2 ; also sheet 4
D01READL: A01.K2 A02.K2 A03.K2 A04.K2 A05.K2 A06.K2 A07.K2 A08.K2 A09.K2 A10.K2 A11.K2 A12.K2 A13.K2 A14.K2 ; also sheet 4
D01RETURN: A01.R2 A02.R2 A03.R2 A04.R2 A05.R2 A06.R2 A07.R2 A08.R2 A09.R2 A10.R2 A11.R2 A12.R2 A13.R2 A14.R2 ; also sheet 4
D01SOURCE: A01.L2 A02.L2 A03.L2 A04.L2 A05.L2 A06.L2 A07.L2 A08.L2 A09.L2 A10.L2 A11.L2 A12.L2 A13.L2 A14.L2 ; also sheet 4
D01STROBE: A01.M2 A02.M2 A03.M2 A04.M2 A05.M2 A06.M2 A07.M2 A08.M2 A09.M2 A10.M2 A11.M2 A12.M2 A13.M2 A14.M2 ; also sheet 4
D01WRITE: A01.S2 A02.S2 A03.S2 A04.S2 A05.S2 A06.S2 A07.S2 A08.S2 A09.S2 A10.S2 A11.S2 A12.S2 A13.S2 A14.S2 ; also sheet 4
D03BEMA0L: A01.D2 A02.D2 A03.D2 A04.D2 A05.D2 A06.D2 A07.D2 A08.D2 A09.D2 A10.D2 A11.D2 A12.D2 A13.D2 A14.D2 ; also sheet 1
D03BEMA1L: A01.E2 A02.E2 A03.E2 A04.E2 A05.E2 A06.E2 A07.E2 A08.E2 A09.E2 A10.E2 A11.E2 A12.E2 A13.E2 A14.E2 ; also sheet 1
D03BEMA2L: A01.H2 A02.H2 A03.H2 A04.H2 A05.H2 A06.H2 A07.H2 A08.H2 A09.H2 A10.H2 A11.H2 A12.H2 A13.H2 A14.H2 ; also sheet 1
D03MA0L: A01.D1 A02.D1 A03.D1 A04.D1 A05.D1 A06.D1 A07.D1 A08.D1 A09.D1 A10.D1 A11.D1 A12.D1 A13.D1 A14.D1 ; also sheet 1
D03MA1L: A01.E1 A02.E1 A03.E1 A04.E1 A05.E1 A06.E1 A07.E1 A08.E1 A09.E1 A10.E1 A11.E1 A12.E1 A13.E1 A14.E1 ; also sheet 1
D03MA2L: A01.H1 A02.H1 A03.H1 A04.H1 A05.H1 A06.H1 A07.H1 A08.H1 A09.H1 A10.H1 A11.H1 A12.H1 A13.H1 A14.H1 ; also sheet 1
D03MA3L: A01.J1 A02.J1 A03.J1 A04.J1 A05.J1 A06.J1 A07.J1 A08.J1 A09.J1 A10.J1 A11.J1 A12.J1 A13.J1 A14.J1 ; also sheet 1
D03MA4L: B01.D1 B02.D1 B03.D1 B04.D1 B05.D1 B06.D1 B07.D1 B08.D1 B09.D1 B10.D1 B11.D1 B12.D1 B13.D1 B14.D1 ; also sheet 1
D03MA5L: B01.E1 B02.E1 B03.E1 B04.E1 B05.E1 B06.E1 B07.E1 B08.E1 B09.E1 B10.E1 B11.E1 B12.E1 B13.E1 B14.E1 ; also sheet 1
D03MA6L: B01.H1 B02.H1 B03.H1 B04.H1 B05.H1 B06.H1 B07.H1 B08.H1 B09.H1 B10.H1 B11.H1 B12.H1 B13.H1 B14.H1 ; also sheet 1
D03MA7L: B01.J1 B02.J1 B03.J1 B04.J1 B05.J1 B06.J1 B07.J1 B08.J1 B09.J1 B10.J1 B11.J1 B12.J1 B13.J1 B14.J1 ; also sheet 1
D03MA8L: D01.D1 D02.D1 D03.D1 D04.D1 D05.D1 D06.D1 D07.D1 D08.D1 D09.D1 D10.D1 D11.D1 D12.D1 D13.D1 D14.D1 ; also sheet 1
D03MA9L: D01.E1 D02.E1 D03.E1 D04.E1 D05.E1 D06.E1 D07.E1 D08.E1 D09.E1 D10.E1 D11.E1 D12.E1 D13.E1 D14.E1 ; also sheet 1
D03MA10L: D01.H1 D02.H1 D03.H1 D04.H1 D05.H1 D06.H1 D07.H1 D08.H1 D09.H1 D10.H1 D11.H1 D12.H1 D13.H1 D14.H1 ; also sheet 1
D03MA11L: D01.J1 D02.J1 D03.J1 D04.J1 D05.J1 D06.J1 D07.J1 D08.J1 D09.J1 D10.J1 D11.J1 D12.J1 D13.J1 D14.J1 ; also sheet 1
D04MD0L: A01.K1 A02.K1 A03.K1 A04.K1 A05.K1 A06.K1 A07.K1 A08.K1 A09.K1 A10.K1 A11.K1 A12.K1 A13.K1 A14.K1 ; also sheet 3
D04MD1L: A01.L1 A02.L1 A03.L1 A04.L1 A05.L1 A06.L1 A07.L1 A08.L1 A09.L1 A10.L1 A11.L1 A12.L1 A13.L1 A14.L1 ; also sheet 3
D04MD2L: A01.M1 A02.M1 A03.M1 A04.M1 A05.M1 A06.M1 A07.M1 A08.M1 A09.M1 A10.M1 A11.M1 A12.M1 A13.M1 A14.M1 ; also sheet 3
D04MD3L: A01.P1 A02.P1 A03.P1 A04.P1 A05.P1 A06.P1 A07.P1 A08.P1 A09.P1 A10.P1 A11.P1 A12.P1 A13.P1 A14.P1 ; also sheet 3
D04MD4L: B01.K1 B02.K1 B03.K1 B04.K1 B05.K1 B06.K1 B07.K1 B08.K1 B09.K1 B10.K1 B11.K1 B12.K1 B13.K1 B14.K1 ; also sheet 3
D04MD5L: B01.L1 B02.L1 B03.L1 B04.L1 B05.L1 B06.L1 B07.L1 B08.L1 B09.L1 B10.L1 B11.L1 B12.L1 B13.L1 B14.L1 ; also sheet 3
D04MD6L: B01.M1 B02.M1 B03.M1 B04.M1 B05.M1 B06.M1 B07.M1 B08.M1 B09.M1 B10.M1 B11.M1 B12.M1 B13.M1 B14.M1 ; also sheet 3
D04MD7L: B01.P1 B02.P1 B03.P1 B04.P1 B05.P1 B06.P1 B07.P1 B08.P1 B09.P1 B10.P1 B11.P1 B12.P1 B13.P1 B14.P1 ; also sheet 3
D04MD8L: D01.K1 D02.K1 D03.K1 D04.K1 D05.K1 D06.K1 D07.K1 D08.K1 D09.K1 D10.K1 D11.K1 D12.K1 D13.K1 D14.K1 ; also sheet 3
D04MD9L: D01.L1 D02.L1 D03.L1 D04.L1 D05.L1 D06.L1 D07.L1 D08.L1 D09.L1 D10.L1 D11.L1 D12.L1 D13.L1 D14.L1 ; also sheet 3
D04MD10L: D01.M1 D02.M1 D03.M1 D04.M1 D05.M1 D06.M1 D07.M1 D08.M1 D09.M1 D10.M1 D11.M1 D12.M1 D13.M1 D14.M1 ; also sheet 3
D04MD11L: D01.P1 D02.P1 D03.P1 D04.P1 D05.P1 D06.P1 D07.P1 D08.P1 D09.P1 D10.P1 D11.P1 D12.P1 D13.P1 D14.P1 ; also sheet 3
GND [Power]: A01.C1 A01.C2 A01.F1 A01.F2 A01.N1 A01.N2 A01.T1 A01.T2 A02.C1 A02.C2 A02.F1 A02.F2 A02.N1 A02.N2 A02.T1 A02.T2 A03.C1 A03.C2 A03.F1 A03.F2 A03.N1 A03.N2 A03.T1 A03.T2 A04.C1 A04.C2 A04.F1 A04.F2 A04.N1 A04.N2 A04.T1 A04.T2 A05.C1 A05.C2 A05.F1 A05.F2 A05.N1 A05.N2 A05.T1 A05.T2 A06.C1 A06.C2 A06.F1 A06.F2 A06.N1 A06.N2 A06.T1 A06.T2 A07.C1 A07.C2 A07.F1 A07.F2 A07.N1 A07.N2 A07.T1 A07.T2 A08.C1 A08.C2 A08.F1 A08.F2 A08.N1 A08.N2 A08.T1 A08.T2 A09.C1 A09.C2 A09.F1 A09.F2 A09.N1 A09.N2 A09.T1 A09.T2 A10.C1 A10.C2 A10.F1 A10.F2 A10.N1 A10.N2 A10.T1 A10.T2 A11.C1 A11.C2 A11.F1 A11.F2 A11.N1 A11.N2 A11.T1 A11.T2 A12.C1 A12.C2 A12.F1 A12.F2 A12.N1 A12.N2 A12.T1 A12.T2 A13.C1 A13.C2 A13.F1 A13.F2 A13.N1 A13.N2 A13.T1 A13.T2 A14.C1 A14.C2 A14.F1 A14.F2 A14.N1 A14.N2 A14.T1 A14.T2 B01.C1 B01.C2 B01.F1 B01.F2 B01.N1 B01.N2 B01.T1 B01.T2 B02.C1 B02.C2 B02.F1 B02.F2 B02.N1 B02.N2 B02.T1 B02.T2 B03.C1 B03.C2 B03.F1 B03.F2 B03.N1 B03.N2 B03.T1 B03.T2 B04.C1 B04.C2 B04.F1 B04.F2 B04.N1 B04.N2 B04.T1 B04.T2 B05.C1 B05.C2 B05.F1 B05.F2 B05.N1 B05.N2 B05.T1 B05.T2 B06.C1 B06.C2 B06.F1 B06.F2 B06.N1 B06.N2 B06.T1 B06.T2 B07.C1 B07.C2 B07.F1 B07.F2 B07.N1 B07.N2 B07.T1 B07.T2 B08.C1 B08.C2 B08.F1 B08.F2 B08.N1 B08.N2 B08.T1 B08.T2 B09.C1 B09.C2 B09.F1 B09.F2 B09.N1 B09.N2 B09.T1 B09.T2 B10.C1 B10.C2 B10.F1 B10.F2 B10.N1 B10.N2 B10.T1 B10.T2 B11.C1 B11.C2 B11.F1 B11.F2 B11.N1 B11.N2 B11.T1 B11.T2 B12.C1 B12.C2 B12.F1 B12.F2 B12.N1 B12.N2 B12.T1 B12.T2 B13.C1 B13.C2 B13.F1 B13.F2 B13.N1 B13.N2 B13.T1 B13.T2 B14.C1 B14.C2 B14.F1 B14.F2 B14.N1 B14.N2 B14.T1 B14.T2 C01.C1 C01.C2 C01.F1 C01.F2 C01.N1 C01.N2 C01.T1 C01.T2 C02.C1 C02.C2 C02.F1 C02.F2 C02.N1 C02.N2 C02.T1 C02.T2 C03.C1 C03.C2 C03.F1 C03.F2 C03.N1 C03.N2 C03.T1 C03.T2 C04.C1 C04.C2 C04.F1 C04.F2 C04.N1 C04.N2 C04.T1 C04.T2 C05.C1 C05.C2 C05.F1 C05.F2 C05.N1 C05.N2 C05.T1 C05.T2 C06.C1 C06.C2 C06.F1 C06.F2 C06.N1 C06.N2 C06.T1 C06.T2 C07.C1 C07.C2 C07.F1 C07.F2 C07.N1 C07.N2 C07.T1 C07.T2 C08.C1 C08.C2 C08.F1 C08.F2 C08.N1 C08.N2 C08.T1 C08.T2 C09.C1 C09.C2 C09.F1 C09.F2 C09.N1 C09.N2 C09.T1 C09.T2 C10.C1 C10.C2 C10.F1 C10.F2 C10.N1 C10.N2 C10.T1 C10.T2 C11.C1 C11.C2 C11.F1 C11.F2 C11.N1 C11.N2 C11.T1 C11.T2 C12.C1 C12.C2 C12.F1 C12.F2 C12.N1 C12.N2 C12.T1 C12.T2 C13.C1 C13.C2 C13.F1 C13.F2 C13.N1 C13.N2 C13.T1 C13.T2 C14.C1 C14.C2 C14.F1 C14.F2 C14.N1 C14.N2 C14.T1 C14.T2 D01.C1 D01.C2 D01.F1 D01.F2 D01.N1 D01.N2 D01.T1 D01.T2 D02.C1 D02.C2 D02.F1 D02.F2 D02.N1 D02.N2 D02.T1 D02.T2 D03.C1 D03.C2 D03.F1 D03.F2 D03.N1 D03.N2 D03.T1 D03.T2 D04.C1 D04.C2 D04.F1 D04.F2 D04.N1 D04.N2 D04.T1 D04.T2 D05.C1 D05.C2 D05.F1 D05.F2 D05.N1 D05.N2 D05.T1 D05.T2 D06.C1 D06.C2 D06.F1 D06.F2 D06.N1 D06.N2 D06.T1 D06.T2 D07.C1 D07.C2 D07.F1 D07.F2 D07.N1 D07.N2 D07.T1 D07.T2 D08.C1 D08.C2 D08.F1 D08.F2 D08.N1 D08.N2 D08.T1 D08.T2 D09.C1 D09.C2 D09.F1 D09.F2 D09.N1 D09.N2 D09.T1 D09.T2 D10.C1 D10.C2 D10.F1 D10.F2 D10.N1 D10.N2 D10.T1 D10.T2 D11.C1 D11.C2 D11.F1 D11.F2 D11.N1 D11.N2 D11.T1 D11.T2 D12.C1 D12.C2 D12.F1 D12.F2 D12.N1 D12.N2 D12.T1 D12.T2 D13.C1 D13.C2 D13.F1 D13.F2 D13.N1 D13.N2 D13.T1 D13.T2 D14.C1 D14.C2 D14.F1 D14.F2 D14.N1 D14.N2 D14.T1 D14.T2 GND.1(P) ; also sheet 4
N$10: A01.A1 A02.A1 A03.A1 A04.A1 A05.A1 A06.A1 A07.A1 A08.A1 A09.A1 A10.A1 A11.A1 A12.A1 A13.A1 A14.A1
N$28: A01.B1 A02.B1 A03.B1 A04.B1 A05.B1 A06.B1 A07.B1 A08.B1 A09.B1 A10.B1 A11.B1 A12.B1 A13.B1 A14.B1
N$49: A01.J2 A02.J2 A03.J2 A04.J2 A05.J2 A06.J2 A07.J2 A08.J2 A09.J2 A10.J2 A11.J2 A12.J2 A13.J2 A14.J2
N$62: A01.R1 A02.R1 A03.R1 A04.R1 A05.R1 A06.R1 A07.R1 A08.R1 A09.R1 A10.R1 A11.R1 A12.R1 A13.R1 A14.R1
N$64: A01.S1 A02.S1 A03.S1 A04.S1 A05.S1 A06.S1 A07.S1 A08.S1 A09.S1 A10.S1 A11.S1 A12.S1 A13.S1 A14.S1
N$70: A01.U1 A02.U1 A03.U1 A04.U1 A05.U1 A06.U1 A07.U1 A08.U1 A09.U1 A10.U1 A11.U1 A12.U1 A13.U1 A14.U1
N$72: A01.V1 A02.V1 A03.V1 A04.V1 A05.V1 A06.V1 A07.V1 A08.V1 A09.V1 A10.V1 A11.V1 A12.V1 A13.V1 A14.V1
N$74: A01.V2 A02.V2 A03.V2 A04.V2 A05.V2 A06.V2 A07.V2 A08.V2 A09.V2 A10.V2 A11.V2 A12.V2 A13.V2 A14.V2
N$75: B01.A1 B02.A1 B03.A1 B04.A1 B05.A1 B06.A1 B07.A1 B08.A1 B09.A1 B10.A1 B11.A1 B12.A1 B13.A1 B14.A1
N$77: B01.B1 B02.B1 B03.B1 B04.B1 B05.B1 B06.B1 B07.B1 B08.B1 B09.B1 B10.B1 B11.B1 B12.B1 B13.B1 B14.B1
N$82: B01.D2 B02.D2 B03.D2 B04.D2 B05.D2 B06.D2 B07.D2 B08.D2 B09.D2 B10.D2 B11.D2 B12.D2 B13.D2 B14.D2
N$85: B01.E2 B02.E2 B03.E2 B04.E2 B05.E2 B06.E2 B07.E2 B08.E2 B09.E2 B10.E2 B11.E2 B12.E2 B13.E2 B14.E2
N$89: B01.H2 B02.H2 B03.H2 B04.H2 B05.H2 B06.H2 B07.H2 B08.H2 B09.H2 B10.H2 B11.H2 B12.H2 B13.H2 B14.H2
N$98: B01.J2 B02.J2 B03.J2 B04.J2 B05.J2 B06.J2 B07.J2 B08.J2 B09.J2 B10.J2 B11.J2 B12.J2 B13.J2 B14.J2
N$105: B01.K2 B02.K2 B03.K2 B04.K2 B05.K2 B06.K2 B07.K2 B08.K2 B09.K2 B10.K2 B11.K2 B12.K2 B13.K2 B14.K2
N$107: B01.L2 B02.L2 B03.L2 B04.L2 B05.L2 B06.L2 B07.L2 B08.L2 B09.L2 B10.L2 B11.L2 B12.L2 B13.L2 B14.L2
N$115: B01.M2 B02.M2 B03.M2 B04.M2 B05.M2 B06.M2 B07.M2 B08.M2 B09.M2 B10.M2 B11.M2 B12.M2 B13.M2 B14.M2
N$121: B01.P2 B02.P2 B03.P2 B04.P2 B05.P2 B06.P2 B07.P2 B08.P2 B09.P2 B10.P2 B11.P2 B12.P2 B13.P2 B14.P2
N$123: B01.R1 B02.R1 B03.R1 B04.R1 B05.R1 B06.R1 B07.R1 B08.R1 B09.R1 B10.R1 B11.R1 B12.R1 B13.R1 B14.R1
N$126: B01.R2 B02.R2 B03.R2 B04.R2 B05.R2 B06.R2 B07.R2 B08.R2 B09.R2 B10.R2 B11.R2 B12.R2 B13.R2 B14.R2
N$127: B01.S1 B02.S1 B03.S1 B04.S1 B05.S1 B06.S1 B07.S1 B08.S1 B09.S1 B10.S1 B11.S1 B12.S1 B13.S1 B14.S1
N$130: B01.S2 B02.S2 B03.S2 B04.S2 B05.S2 B06.S2 B07.S2 B08.S2 B09.S2 B10.S2 B11.S2 B12.S2 B13.S2 B14.S2
N$134: B01.U1 B02.U1 B03.U1 B04.U1 B05.U1 B06.U1 B07.U1 B08.U1 B09.U1 B10.U1 B11.U1 B12.U1 B13.U1 B14.U1
N$135: B01.U2 B02.U2 B03.U2 B04.U2 B05.U2 B06.U2 B07.U2 B08.U2 B09.U2 B10.U2 B11.U2 B12.U2 B13.U2 B14.U2
N$136: B01.V1 B02.V1 B03.V1 B04.V1 B05.V1 B06.V1 B07.V1 B08.V1 B09.V1 B10.V1 B11.V1 B12.V1 B13.V1 B14.V1
N$141: C01.A1 C02.A1 C03.A1 C04.A1 C05.A1 C06.A1 C07.A1 C08.A1 C09.A1 C10.A1 C11.A1 C12.A1 C13.A1 C14.A1
N$144: C01.B1 C02.B1 C03.B1 C04.B1 C05.B1 C06.B1 C07.B1 C08.B1 C09.B1 C10.B1 C11.B1 C12.B1 C13.B1 C14.B1
N$154: C01.D1 C02.D1 C03.D1 C04.D1 C05.D1 C06.D1 C07.D1 C08.D1 C09.D1 C10.D1 C11.D1 C12.D1 C13.D1 C14.D1
N$156: C01.D2 C02.D2 C03.D2 C04.D2 C05.D2 C06.D2 C07.D2 C08.D2 C09.D2 C10.D2 C11.D2 C12.D2 C13.D2 C14.D2
N$157: C01.E1 C02.E1 C03.E1 C04.E1 C05.E1 C06.E1 C07.E1 C08.E1 C09.E1 C10.E1 C11.E1 C12.E1 C13.E1 C14.E1
N$158: C01.E2 C02.E2 C03.E2 C04.E2 C05.E2 C06.E2 C07.E2 C08.E2 C09.E2 C10.E2 C11.E2 C12.E2 C13.E2 C14.E2
N$163: C01.H1 C02.H1 C03.H1 C04.H1 C05.H1 C06.H1 C07.H1 C08.H1 C09.H1 C10.H1 C11.H1 C12.H1 C13.H1 C14.H1
N$164: C01.H2 C02.H2 C03.H2 C04.H2 C05.H2 C06.H2 C07.H2 C08.H2 C09.H2 C10.H2 C11.H2 C12.H2 C13.H2 C14.H2
N$165: C01.J1 C02.J1 C03.J1 C04.J1 C05.J1 C06.J1 C07.J1 C08.J1 C09.J1 C10.J1 C11.J1 C12.J1 C13.J1 C14.J1
N$166: C01.J2 C02.J2 C03.J2 C04.J2 C05.J2 C06.J2 C07.J2 C08.J2 C09.J2 C10.J2 C11.J2 C12.J2 C13.J2 C14.J2
N$167: C01.K1 C02.K1 C03.K1 C04.K1 C05.K1 C06.K1 C07.K1 C08.K1 C09.K1 C10.K1 C11.K1 C12.K1 C13.K1 C14.K1
N$168: C01.K2 C02.K2 C03.K2 C04.K2 C05.K2 C06.K2 C07.K2 C08.K2 C09.K2 C10.K2 C11.K2 C12.K2 C13.K2 C14.K2
N$169: C01.L1 C02.L1 C03.L1 C04.L1 C05.L1 C06.L1 C07.L1 C08.L1 C09.L1 C10.L1 C11.L1 C12.L1 C13.L1 C14.L1
N$170: C01.L2 C02.L2 C03.L2 C04.L2 C05.L2 C06.L2 C07.L2 C08.L2 C09.L2 C10.L2 C11.L2 C12.L2 C13.L2 C14.L2
N$171: C01.M1 C02.M1 C03.M1 C04.M1 C05.M1 C06.M1 C07.M1 C08.M1 C09.M1 C10.M1 C11.M1 C12.M1 C13.M1 C14.M1
N$172: C01.M2 C02.M2 C03.M2 C04.M2 C05.M2 C06.M2 C07.M2 C08.M2 C09.M2 C10.M2 C11.M2 C12.M2 C13.M2 C14.M2
N$175: C01.P1 C02.P1 C03.P1 C04.P1 C05.P1 C06.P1 C07.P1 C08.P1 C09.P1 C10.P1 C11.P1 C12.P1 C13.P1 C14.P1
N$176: C01.P2 C02.P2 C03.P2 C04.P2 C05.P2 C06.P2 C07.P2 C08.P2 C09.P2 C10.P2 C11.P2 C12.P2 C13.P2 C14.P2
N$177: C01.R1 C02.R1 C03.R1 C04.R1 C05.R1 C06.R1 C07.R1 C08.R1 C09.R1 C10.R1 C11.R1 C12.R1 C13.R1 C14.R1
N$178: C01.R2 C02.R2 C03.R2 C04.R2 C05.R2 C06.R2 C07.R2 C08.R2 C09.R2 C10.R2 C11.R2 C12.R2 C13.R2 C14.R2
N$179: C01.S1 C02.S1 C03.S1 C04.S1 C05.S1 C06.S1 C07.S1 C08.S1 C09.S1 C10.S1 C11.S1 C12.S1 C13.S1 C14.S1
N$180: C01.S2 C02.S2 C03.S2 C04.S2 C05.S2 C06.S2 C07.S2 C08.S2 C09.S2 C10.S2 C11.S2 C12.S2 C13.S2 C14.S2
N$183: C01.U1 C02.U1 C03.U1 C04.U1 C05.U1 C06.U1 C07.U1 C08.U1 C09.U1 C10.U1 C11.U1 C12.U1 C13.U1 C14.U1
N$184: C01.U2 C02.U2 C03.U2 C04.U2 C05.U2 C06.U2 C07.U2 C08.U2 C09.U2 C10.U2 C11.U2 C12.U2 C13.U2 C14.U2
N$186: C01.V1 C02.V1 C03.V1 C04.V1 C05.V1 C06.V1 C07.V1 C08.V1 C09.V1 C10.V1 C11.V1 C12.V1 C13.V1 C14.V1
N$187: C01.V2 C02.V2 C03.V2 C04.V2 C05.V2 C06.V2 C07.V2 C08.V2 C09.V2 C10.V2 C11.V2 C12.V2 C13.V2 C14.V2
N$188: D01.A1 D02.A1 D03.A1 D04.A1 D05.A1 D06.A1 D07.A1 D08.A1 D09.A1 D10.A1 D11.A1 D12.A1 D13.A1 D14.A1
N$190: D01.B1 D02.B1 D03.B1 D04.B1 D05.B1 D06.B1 D07.B1 D08.B1 D09.B1 D10.B1 D11.B1 D12.B1 D13.B1 D14.B1
N$196: D01.D2 D02.D2 D03.D2 D04.D2 D05.D2 D06.D2 D07.D2 D08.D2 D09.D2 D10.D2 D11.D2 D12.D2 D13.D2 D14.D2
N$198: D01.E2 D02.E2 D03.E2 D04.E2 D05.E2 D06.E2 D07.E2 D08.E2 D09.E2 D10.E2 D11.E2 D12.E2 D13.E2 D14.E2
N$202: D01.H2 D02.H2 D03.H2 D04.H2 D05.H2 D06.H2 D07.H2 D08.H2 D09.H2 D10.H2 D11.H2 D12.H2 D13.H2 D14.H2
N$204: D01.J2 D02.J2 D03.J2 D04.J2 D05.J2 D06.J2 D07.J2 D08.J2 D09.J2 D10.J2 D11.J2 D12.J2 D13.J2 D14.J2
N$206: D01.K2 D02.K2 D03.K2 D04.K2 D05.K2 D06.K2 D07.K2 D08.K2 D09.K2 D10.K2 D11.K2 D12.K2 D13.K2 D14.K2
N$208: D01.L2 D02.L2 D03.L2 D04.L2 D05.L2 D06.L2 D07.L2 D08.L2 D09.L2 D10.L2 D11.L2 D12.L2 D13.L2 D14.L2
N$210: D01.M2 D02.M2 D03.M2 D04.M2 D05.M2 D06.M2 D07.M2 D08.M2 D09.M2 D10.M2 D11.M2 D12.M2 D13.M2 D14.M2
N$214: D01.P2 D02.P2 D03.P2 D04.P2 D05.P2 D06.P2 D07.P2 D08.P2 D09.P2 D10.P2 D11.P2 D12.P2 D13.P2 D14.P2
N$215: D01.R1 D02.R1 D03.R1 D04.R1 D05.R1 D06.R1 D07.R1 D08.R1 D09.R1 D10.R1 D11.R1 D12.R1 D13.R1 D14.R1
N$216: D01.R2 D02.R2 D03.R2 D04.R2 D05.R2 D06.R2 D07.R2 D08.R2 D09.R2 D10.R2 D11.R2 D12.R2 D13.R2 D14.R2
N$218: D01.S2 D02.S2 D03.S2 D04.S2 D05.S2 D06.S2 D07.S2 D08.S2 D09.S2 D10.S2 D11.S2 D12.S2 D13.S2 D14.S2
N$221: D01.U1 D02.U1 D03.U1 D04.U1 D05.U1 D06.U1 D07.U1 D08.U1 D09.U1 D10.U1 D11.U1 D12.U1 D13.U1 D14.U1
N$222: D01.U2 D02.U2 D03.U2 D04.U2 D05.U2 D06.U2 D07.U2 D08.U2 D09.U2 D10.U2 D11.U2 D12.U2 D13.U2 D14.U2
N$223: D01.V1 D02.V1 D03.V1 D04.V1 D05.V1 D06.V1 D07.V1 D08.V1 D09.V1 D10.V1 D11.V1 D12.V1 D13.V1 D14.V1
N$224: D01.V2 D02.V2 D03.V2 D04.V2 D05.V2 D06.V2 D07.V2 D08.V2 D09.V2 D10.V2 D11.V2 D12.V2 D13.V2 D14.V2
VCC [Power]: +5V.1(P) A01.A2 A02.A2 A03.A2 A04.A2 A05.A2 A06.A2 A07.A2 A08.A2 A09.A2 A10.A2 A11.A2 A12.A2 A13.A2 A14.A2 B01.A2 B02.A2 B03.A2 B04.A2 B05.A2 B06.A2 B07.A2 B08.A2 B09.A2 B10.A2 B11.A2 B12.A2 B13.A2 B14.A2 C01.A2 C02.A2 C03.A2 C04.A2 C05.A2 C06.A2 C07.A2 C08.A2 C09.A2 C10.A2 C11.A2 C12.A2 C13.A2 C14.A2 D01.A2 D02.A2 D03.A2 D04.A2 D05.A2 D06.A2 D07.A2 D08.A2 D09.A2 D10.A2 D11.A2 D12.A2 D13.A2 D14.A2

### Notes on the sheet
- A01 thru A14 | B01 thru B14 | C01 thru C14 | D01 thru D14
- Unused Slot:
- Omnibus Memory Connectors
- BM812-I-5

## Power pins joined to a net without a drawn wire
GND: A15.C2(GND) A15.T1(GND) A16.A1 A16.C1 A16.C2 A16.F1 A16.F2 A16.J2 A16.K1 A16.L2 A16.N1 A16.N2 A16.R1 A16.R2 A16.T1 A16.U2 A17N.A1 A17N.C1 A17N.C2 A17N.F1 A17N.F2 A17N.J2 A17N.K1 A17N.L2 A17N.N1 A17N.N2 A17N.R1 A17N.R2 A17N.T1 A17N.U2 A18N.A1 A18N.C1 A18N.C2 A18N.F1 A18N.F2 A18N.J2 A18N.K1 A18N.L2 A18N.N1 A18N.N2 A18N.R1 A18N.R2 A18N.T1 A18N.U2 A19N.A1 A19N.C1 A19N.C2 A19N.F1 A19N.F2 A19N.J2 A19N.K1 A19N.L2 A19N.N1 A19N.N2 A19N.R1 A19N.R2 A19N.T1 A19N.U2 A20N.A1 A20N.C1 A20N.C2 A20N.F1 A20N.F2 A20N.J2 A20N.K1 A20N.L2 A20N.N1 A20N.N2 A20N.R1 A20N.R2 A20N.T1 A20N.U2 B15.C2(GND) B15.T1(GND) B16.C2(GND) B16.T1(GND) B17.C2(GND) B17.T1(GND) B18.C2(GND) B18.T1(GND) B18.U1(GND) B18.V1(GND) B19.C2(GND) B19.T1(GND) B19.U1(GND) B19.V1(GND) B20.C2(GND) B20.T1(GND) B20.U1(GND) B20.V1(GND) C15.C2(GND) C15.T1(GND) C16.C2(GND) C16.T1(GND) C17.C2(GND) C17.T1(GND) C18.C2(GND) C18.T1(GND) C19.C2(GND) C19.T1(GND) C20.C2(GND) C20.T1(GND) D15.C2(GND) D15.T1(GND) D16.C2(GND) D16.T1(GND) D17.C2(GND) D17.T1(GND) D18.C2(GND) D18.T1(GND)
VCC: A15.A2(VCC) B15.A2(VCC) B16.A2(VCC) B17.A2(VCC) B18.A2(VCC) B19.A2(VCC) B20.A2(VCC) C15.A2(VCC) C16.A2(VCC) C17.A2(VCC) C18.A2(VCC) C19.A2(VCC) C20.A2(VCC) D15.A2(VCC) D16.A2(VCC) D17.A2(VCC) D18.A2(VCC)

## Library data of the parts
+5V -15V GND = wirepad:2,54/0,8: THROUGH-HOLE PAD
A01-A09 A10-A14 B01-B09 B10-B14 C01-C09 C10-C14 D01-D09 D10-D14 = dec-m:M916: Simple 36 pin connector/wire cable
A15 B15 C15 C16 = dec-m:M627: 6 4-input NAND Power Amplifier
A16 A17N A18N A19N A20N = dec-m:M903: Two-sided Posibus cable/connector.
B16 = dec-m:M115: 8 3-input NAND Gates
B17 = dec-m:M113: 10 2-input NAND Gates
B18-B20 = dec-m:M623: 6 Dual Bus Drivers
C17 D15-D17 = dec-m:M206X: Two sets of 3 D flip-flops
C18-C20 = dec-m:M310: Tapped Delay Line
D18 = dec-m:M111: Sixteen inverters.
D19 = dec-m:M921: Device Code Select Jumper Board
D20 = dec-m:H807: Empty card slot

## Net classes
1 Power: width 0.635 mm